# EAGLE design Voice Module (EAGLE 6.4)
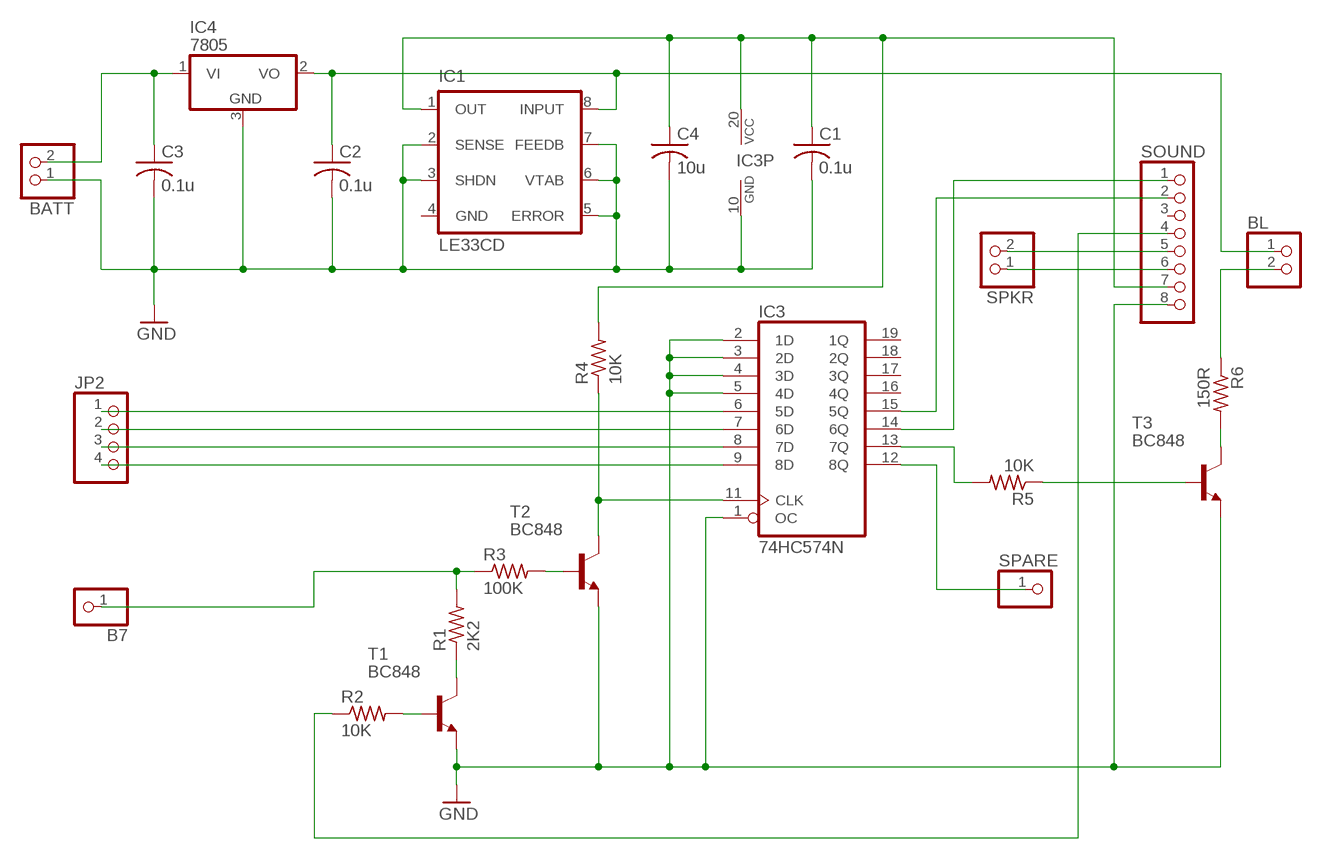
[diagram p0: schematic, sheet 1]

## Parts
B7  PINHD-1X1  [1X01]
BATT  PINHD-1X2  [1X02]
BL  PINHD-1X2  [1X02]
C1  0.1u  C-USC1206  [C1206]
C2  0.1u  C-USC1206  [C1206]
C3  0.1u  C-USC1206  [C1206]
C4  10u  C-USC1206  [C1206]
IC1  LE33CD  LP2951ACM-3.3  [SO-08]
IC3  74HC574N  74HC574D  [SO20W]
IC4  7805  7808DT  [TO252]
JP2  PINHD-1X4  [1X04]
R1  2K2  R-US_R1206  [R1206]
R2  10K  R-US_R1206  [R1206]
R3  100K  R-US_R1206  [R1206]
R4  10K  R-US_R1206  [R1206]
R5  10K  R-US_R1206  [R1206]
R6  150R  R-US_R1206  [R1206]
SOUND  PINHD-1X8  [1X08]
SPARE  PINHD-1X1  [1X01]
SPKR  PINHD-1X2  [1X02]
T1  BC848  [SOT23]
T2  BC848  [SOT23]
T3  BC848  [SOT23]

## Nets
3V3: C1.1 C4.1 IC1.1(OUT) IC3.20(VCC) R4.2 SOUND.7
5V: BL.1 C2.1 IC1.8(INPUT) IC4.2(VO)
BACKLIGHT: IC3.13(7Q) R5.2
BATTERY: BATT.2 C3.1 IC4.1(VI)
BUSY: R2.1 SOUND.4
CLK_AUDIO: IC3.14(6Q) SOUND.1
DATA_AUDIO: IC3.15(5Q) SOUND.2
GND: BATT.1 C1.2 C2.2 C3.2 C4.2 IC1.2(SENSE) IC1.3(SHDN) IC1.5(ERROR) IC1.6(VTAB) IC1.7(FEEDB) IC3.1(OC) IC3.2(1D) IC3.3(2D) IC3.4(3D) IC3.5(4D) IC3.10(GND) IC4.3(GND) SOUND.8 T1.2(E) T2.2(E) T3.2(E)
LCD_D0: IC3.6(5D) JP2.1
LCD_D1: IC3.7(6D) JP2.2
LCD_D2: IC3.8(7D) JP2.3
LCD_D3: IC3.9(8D) JP2.4
N$1: R2.2 T1.1(B)
N$2: R1.1 T1.3(C)
N$3: R3.2 T2.1(B)
N$4: IC3.11(CLK) R4.1 T2.3(C)
N$5: R5.1 T3.1(B)
N$6: R6.2 T3.3(C)
N$7: SOUND.6 SPKR.1
N$8: BL.2 R6.1
N$9: SOUND.5 SPKR.2
PB7: B7.1 R1.2 R3.1
SPARE: IC3.12(8Q) SPARE.1
Unconnected: IC3.16(4Q) IC3.17(3Q) IC3.18(2Q) IC3.19(1Q) SOUND.3

## Power pins joined to a net without a drawn wire
GND: IC1.4(GND)

## Library data of the parts
B7 SPARE = pinhead:PINHD-1X1: PIN HEADER
BATT BL SPKR = pinhead:PINHD-1X2: PIN HEADER
C1-C4 = rcl:C-US: CAPACITOR, American symbol
IC1 = v-reg:LP2951?*: Series of Adjustable Micropower Voltage Regulators Source: http://cache.national.com/ds/LP/LP2950.pdf
IC3 = 74xx-eu:74*574: 8-bit D type FLIP FLOP bus driver
IC4 = linear:78*: Positive VOLTAGE REGULATOR Source: http://cache.national.com/ds/LM/LM78L05.pdf http://www.fairchildsemi.com/ds/LM/LM7805.pdf
JP2 = pinhead:PINHD-1X4: PIN HEADER
R1-R6 = rcl:R-US_: RESISTOR, American symbol
SOUND = pinhead:PINHD-1X8: PIN HEADER
T1-T3 = transistor:BC848: NPN TRANSISTOR

## Board
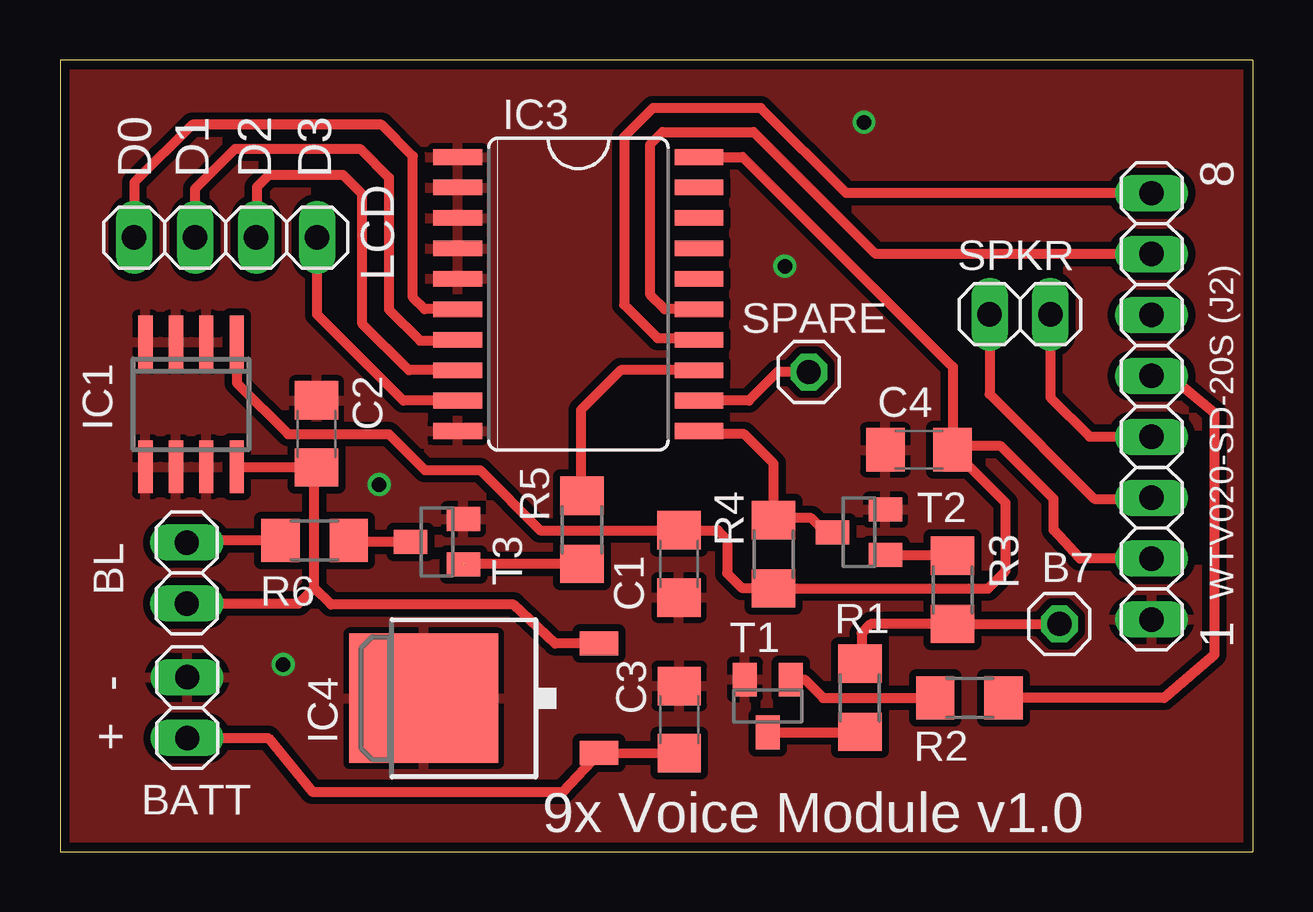
[diagram p1: board, top side]
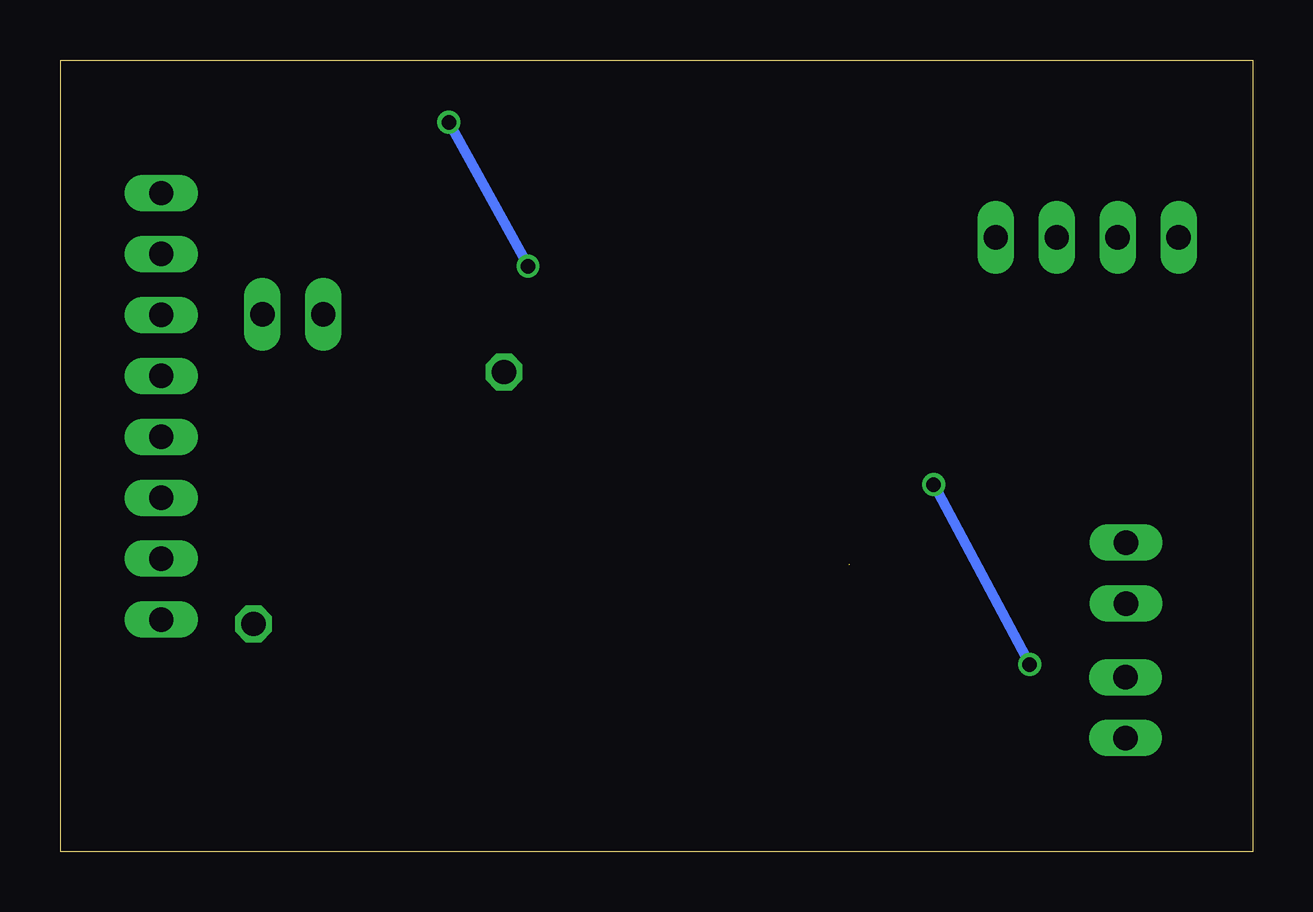
[diagram p2: board, bottom side, seen from below]

Size 49.7 x 33 mm. Coordinates in mm from the lower left corner, seen from the top.
Outline: 0,0 49.7,0 49.7,33 0,33 0,0
Copper layers (1*16): Top 0.0356mm / dielectric 1.5011mm / Bottom 0.0356mm
Design rules "LaenPCBOrder": minimum track width 6mil, minimum drill 13mil, track to track 6mil, track to pad 6mil, pad to pad 6mil, via to via 6mil, smd to smd 6mil, copper to edge 15mil, drill to drill 6mil, minimum pad ring 7mil, minimum via ring 7mil, stop-mask expansion 4mil, vias tented up to drill 0mil, thermal gap 10mil

### Footprints (pad centres in the part's own frame; a part is rotated, then mirrored left to right if it is on the bottom)
1X01 = drill 1.016 octagon: 1 0,0
1X02 = drill 1.016 long: 1 -1.27,0; 2 1.27,0
C1206 = smd 1.6 x 1.8: 1 -1.4,0; 2 1.4,0
SO-08 = smd 0.6 x 2.2: 1 -1.905,-2.6; 2 -0.635,-2.6; 3 0.635,-2.6; 4 1.905,-2.6; 5 1.905,2.6; 6 0.635,2.6; 7 -0.635,2.6; 8 -1.905,2.6
SO20W = smd 0.66 x 2.032: 1 -5.715,-5.029; 2 -4.445,-5.029; 3 -3.175,-5.029; 4 -1.905,-5.029; 5 -0.635,-5.029; 6 0.635,-5.029; 7 1.905,-5.029; 8 3.175,-5.029; 9 4.445,-5.029; 10 5.715,-5.029; 11 5.715,5.029; 12 4.445,5.029; 13 3.175,5.029; 14 1.905,5.029; 15 0.635,5.029; 16 -0.635,5.029; 17 -1.905,5.029; 18 -3.175,5.029; 19 -4.445,5.029; 20 -5.715,5.029
TO252 = smd 1 x 1.6: 1 -2.28,-4.8; 2 2.28,-4.8 | smd 5.4 x 6.2: 3 0,2.5
1X04 = drill 1.016 long: 1 -3.81,0; 2 -1.27,0; 3 1.27,0; 4 3.81,0
R1206 = smd 1.6 x 1.803: 1 -1.422,0; 2 1.422,0
1X08 = drill 1.016 long: 1 -8.89,0; 2 -6.35,0; 3 -3.81,0; 4 -1.27,0; 5 1.27,0; 6 3.81,0; 7 6.35,0; 8 8.89,0
SOT23 = smd 1 x 1.4: 1 -0.95,-1.1; 2 0.95,-1.1; 3 0,1.1

### Placement (x,y rotation side)
B7  41.64,9.49 0 top
BATT  5.3,6 270 top
BL  5.28,11.61 90 top
C1  25.79,11.99 270 top
C2  10.69,17.41 90 top
C3  25.8,5.5 90 top
C4  35.79,16.75 180 top
IC1  5.46,18.64 180 top
IC3  21.6,23.24 270 top
IC4  17.66,6.39 90 top
JP2  6.9,25.6 0 top
R1  33.33,6.41 90 top
R2  37.89,6.41 180 top
R3  37.19,10.91 90 top
R4  29.73,12.39 270 top
R5  21.75,13.41 90 top
R6  10.61,12.97 0 top
SOUND  45.48,18.56 270 top
SPARE  31.2,19.99 0 top
SPKR  40,22.4 0 top
T1  29.49,6.07 180 top
T2  33.29,13.31 90 top
T3  15.71,12.91 90 top

### Tracks (layer width: path | path; a pad name or v marks a point on that pad's centre or on a via)
3V3
  Top 0.406: IC1.1 7.36,19.54 9.5,17.4 13.7,17.4 15.2,15.9 17.5,15.9 20.01,13.39 C1.1 | C1.1 | 29.6,10.5 R4.2 | C1.1 27.41,13.39 27.8,13 27.8,11.6 28.4,11 29.7,11 R4.2 | R4.2 38.67,10.97 39.4,11.7 39.4,14.54 C4.1 | IC3.20 28.45,28.95 37.2,20.2 C4.1 | SOUND.7 42.49,12.21 41.4,13.4 41.4,14.7 39.2,16.9 37.34,16.9 C4.1
5V
  Top 0.406: IC4.2 20.63,8.67 18.9,10.3 11.3,10.3 10.6,11 | 10.6,11 10.6,15.92 C2.1 10.66,16.04 IC1.8 | BL.1 9.94,10.34 10.6,11
BACKLIGHT
  Top 0.406: IC3.13 23.37,20.06 21.7,18.4 21.7,14.88 R5.2
BATTERY
  Top 0.406: C3.1 IC4.1 20.95,2.5 10.5,2.5 8.67,4.73 BATT.2
BUSY
  Top 0.406: SOUND.4 46.27,19.83 48.1,18.3 48.1,8.2 46,6.4 39.32,6.4 R2.1
CLK_AUDIO
  Top 0.406: IC3.14 26.56,21.4 24.9,21.4 23.5,22.8 23.5,29.8 24.7,31 29.2,31 32.75,27.45 SOUND.1
DATA_AUDIO
  Top 0.406: IC3.15 25.2,22.6 24.6,23.2 24.6,29.5 25.1,30 28.9,30 33.99,24.91 SOUND.2
GND  (via drill 0.6)
  Bottom 0.406: v33.5,30.4 v30.2,24.4 | v13.3,15.3 v9.3,7.8
  pour Top (isolate 0.305): 0,33 49.7,33 49.7,0 0,0
LCD_D0
  Top 0.406: IC3.6 15.2,22.6 14.7,23.1 14.7,29 13.4,30.3 5.5,30.3 3.1,27.9 JP2.1
LCD_D1
  Top 0.406: 5.6,25.63 JP2.2 5.63,27.63 7.3,29.3 12.5,29.3 13.7,28.1 13.7,22.6 15,21.3 16.54,21.3 IC3.7
LCD_D2
  Top 0.406: IC3.8 14.53,20.06 12.6,22 12.6,27.4 11.8,28.2 8.7,28.2 8.2,27.7 8.2,25.63 JP2.3
LCD_D3
  Top 0.406: IC3.9 14.3,18.8 10.71,22.39 JP2.4
N$1
  Top 0.406: T1.1 31.03,7.17 31.8,6.4 36.46,6.4 R2.2
N$2
  Top 0.406: T1.3 33.31,4.97 R1.1
N$3
  Top 0.406: T2.1 37.16,12.36 R3.2
N$4
  Top 0.406: 29.63,13.31 R4.1 | T2.3 31.89,13.31 31.3,13.9 29.82,13.9 R4.1 | R4.1 29.73,16.17 28.5,17.4 26.75,17.4 IC3.11
N$5  (1 unrouted)
  Top 0.406: R5.1 16.84,11.99
N$6
  Top 0.406: T3.3 12.03,12.91 R6.2
N$7
  Top 0.406: SPKR.1 38.73,19.07 43.1,14.7 45.43,14.7 SOUND.6
N$8
  Top 0.406: R6.1 5.37,12.97 BL.2
N$9
  Top 0.406: SPKR.2 41.27,18.93 42.9,17.3 SOUND.5
PB7
  Top 0.406: R1.2 33.4,7.9 33.4,9.1 33.79,9.49 R3.1 40.34,9.49 B7.1
SPARE
  Top 0.406: SPARE.1 29.89,19.99 28.7,18.8 IC3.12

### Text on the board
tNames: D0 | D1 | D2 | D3 | LCD | 8 | WTV020-SD-20S (J2) | 1 | - | + | 9x Voice Module v1.0